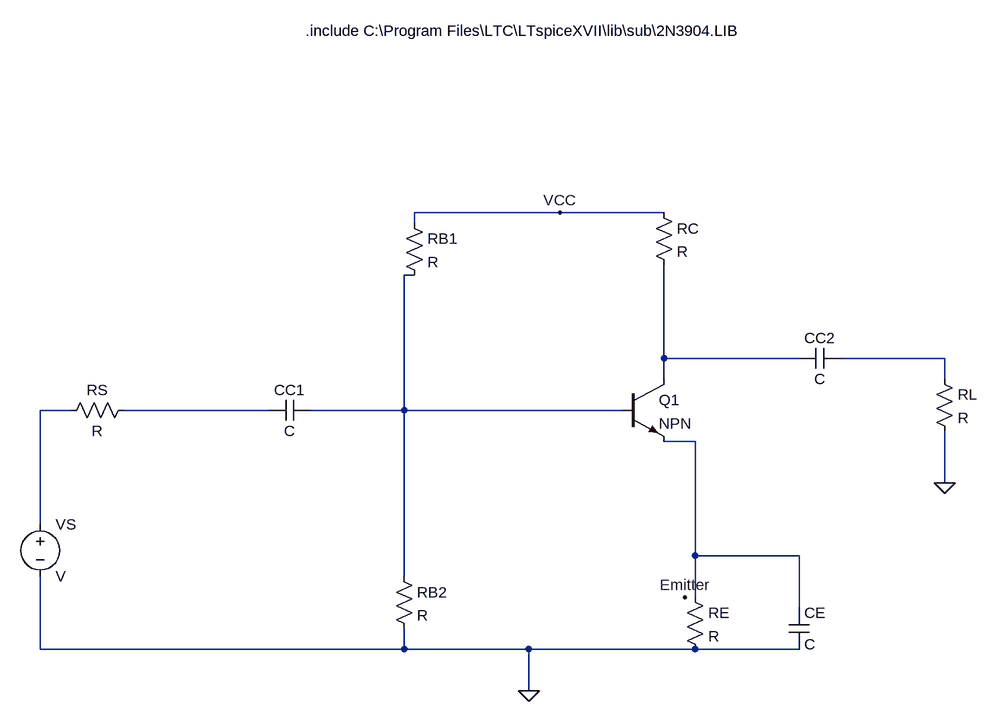
[diagram p0: schematic mp2 task1 small signal version.asc]
mp2 task1 small signal version.asc, the LTspice schematic file:
Version 4
SHEET 1 1240 804
WIRE 288 -16 64 -16
WIRE 448 -16 288 -16
WIRE 64 0 64 -16
WIRE 64 80 48 80
WIRE 448 208 448 64
WIRE 656 208 448 208
WIRE 880 208 720 208
WIRE 448 240 448 208
WIRE 880 240 880 208
WIRE -464 288 -512 288
WIRE -160 288 -384 288
WIRE 48 288 48 80
WIRE 48 288 -96 288
WIRE 384 288 48 288
WIRE 496 336 448 336
WIRE 880 400 880 320
WIRE -512 464 -512 288
WIRE 496 512 496 336
WIRE 656 512 496 512
WIRE 48 544 48 288
WIRE 496 576 496 512
WIRE 656 592 656 512
WIRE -512 656 -512 544
WIRE 48 656 48 624
WIRE 48 656 -512 656
WIRE 240 656 48 656
WIRE 496 656 240 656
WIRE 656 656 496 656
WIRE 240 720 240 656
FLAG 240 720 0
FLAG 288 -16 VCC
FLAG 480 576 Emitter
FLAG 880 400 0
SYMBOL res 48 -16 R0
SYMATTR InstName RB1
SYMBOL res 432 -32 R0
SYMATTR InstName RC
SYMBOL res 32 528 R0
SYMATTR InstName RB2
SYMBOL npn 384 240 R0
SYMATTR InstName Q1
SYMBOL res 480 560 R0
SYMATTR InstName RE
SYMBOL cap -96 272 R90
WINDOW 0 0 32 VBottom 2
WINDOW 3 32 32 VTop 2
SYMATTR InstName CC1
SYMBOL res -368 272 R90
WINDOW 0 0 56 VBottom 2
WINDOW 3 32 56 VTop 2
SYMATTR InstName RS
SYMBOL cap 640 592 R0
SYMATTR InstName CE
SYMBOL cap 720 192 R90
WINDOW 0 0 32 VBottom 2
WINDOW 3 32 32 VTop 2
SYMATTR InstName CC2
SYMBOL res 864 224 R0
SYMATTR InstName RL
SYMBOL voltage -512 448 R0
SYMATTR InstName VS
TEXT -104 -296 Left 2 !.include C:\\Program Files\\LTC\\LTspiceXVII\\lib\\sub\\2N3904.LIB

The netlist it stands for:
* mp2 task1 small signal version.asc
RB1 VCC N001 R
RC VCC N002 R
RB2 N001 0 R
Q1 N002 N001 N006 0 NPN
RE N006 0 R
CC1 N001 N005 C
RS N005 N004 R
CE N006 0 C
CC2 N003 N002 C
RL N003 0 R
VS N004 0 V
.model NPN NPN
.model PNP PNP
.lib standard.bjt
.include C:\Program Files\LTC\LTspiceXVII\lib\sub\2N3904.LIB
.backanno
.end